# EAGLE design cyclops_r2 (EAGLE 5.07)

## Sheet 1 of 3
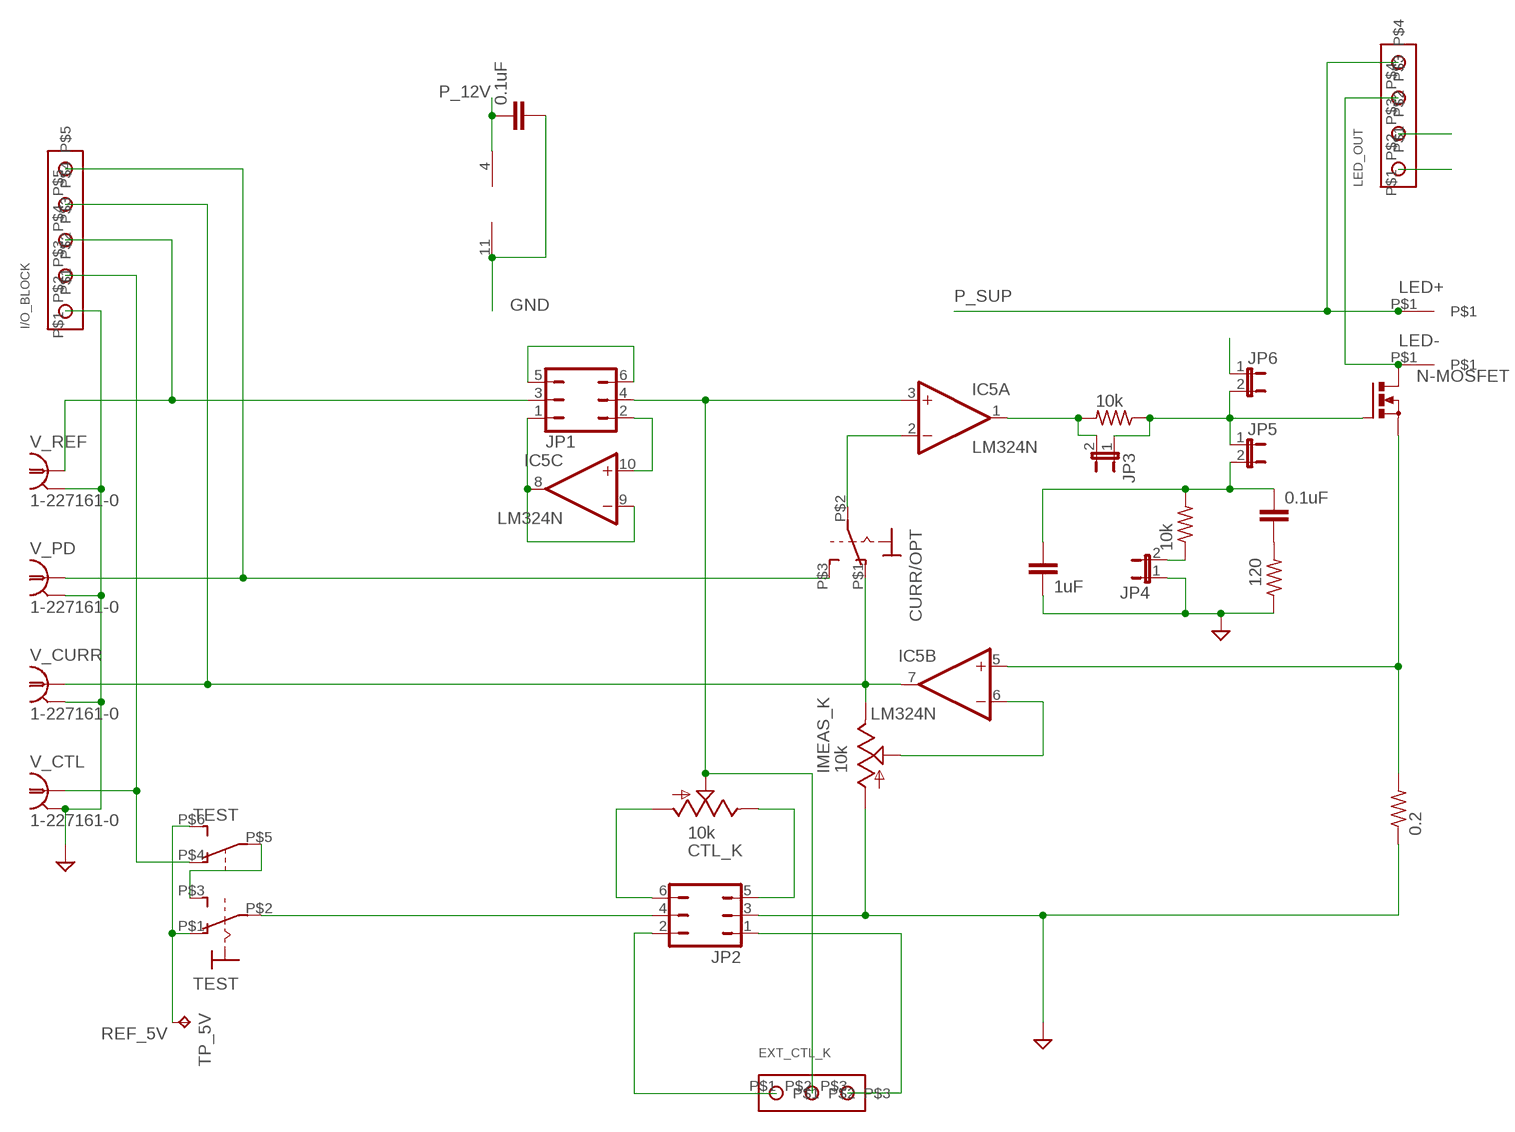
[diagram p0: schematic, sheet 1]

### Parts
C2  0.1uF  C-EU050-024X044  [C050-024X044]
C3  1uF  C-EU025-024X044  [C025-024X044]
C7  0.1uF  C-EU050-024X044  [C050-024X044]
CTL_K  10k  TRIM_US-RJ6S  [RJ6S]
CURR/OPT  SPST_SWITCH  [A_TOGGLE_SPST]
EXT_CTL_K  SCREW3  [SCREW3]
I/O_BLOCK  SCREW5  [SCREW5]
IC5  LM324N  [DIL14]
IMEAS_K  10k  TRIM_US-RJ6S  [RJ6S]
JP1  JP3Q  [JP3Q]
JP2  JP3Q  [JP3Q]
JP3  JP1E  [JP1]
JP4  JP1E  [JP1]
JP5  JP1E  [JP1]
JP6  JP1E  [JP1]
LED+  BANANA_TO_BOARD  [BANANA_TO_BOARD]
LED-  BANANA_TO_BOARD  [BANANA_TO_BOARD]
LED_OUT  SCREW4  [SCREW4]
N-MOSFET  PMOSFET_NTO220BH  [TO220BH]
R3  10k  R-US_0207/7  [0207/7]
R4  10k  R-US_0207/7  [0207/7]
R8  120  R-US_0207/7  [0207/7]
R_CURR  0.2  R-US_  [IMEAS_R]
TEST  SP3T_SWITCH  [320-938]
TP_5V  TPPAD1-13  [P1-13]
V_CTL  1-227161-0  [AMP_227161]
V_CURR  1-227161-0  [AMP_227161]
V_PD  1-227161-0  [AMP_227161]
V_REF  1-227161-0  [AMP_227161]

### Nets
GND: C3.2 C7.2 I/O_BLOCK.P$1 IC5.11(P:V-) IMEAS_K.A JP2.3 JP4.1 LED_OUT.P$1 R8.1 R_CURR.1 V_CTL.2(GND) V_CURR.2(GND) V_PD.2(GND) V_REF.2(GND) ; also sheet 2,3
N$1: CURR/OPT.P$2(P) IC5.2(A:-IN)
N$2: IC5.5(B:+IN) N-MOSFET.S R_CURR.2
N$3: IC5.1(A:OUT) JP3.2 R4.2
N$4: CURR/OPT.P$1(O) I/O_BLOCK.P$4 IC5.7(B:OUT) IMEAS_K.E V_CURR.1
N$5: CURR/OPT.P$3(S) I/O_BLOCK.P$5 V_PD.1
N$6: JP2.4 TEST.P$2(1:P)
N$7: CTL_K.E JP2.5
N$8: CTL_K.S EXT_CTL_K.P$2 IC5.3(A:+IN) JP1.4
N$9: IC5.8(C:OUT) IC5.9(C:-IN) JP1.1
N$10: I/O_BLOCK.P$2 TEST.P$4(B:O) V_CTL.1
N$11: C2.1 C3.1 JP5.2 R3.2
N$12: CTL_K.A JP2.6
N$13: C2.2 R8.2
N$14: IC5.10(C:+IN) JP1.2
N$15: IC5.6(B:-IN) IMEAS_K.S
N$17: JP1.5 JP1.6
N$18: I/O_BLOCK.P$3 JP1.3 V_REF.1
N$21: LED-.P$1 LED_OUT.P$3 N-MOSFET.D
N$23: TEST.P$3(1:S) TEST.P$5(B:P)
N$25: EXT_CTL_K.P$1 JP2.2
N$26: EXT_CTL_K.P$3 JP2.1
N$27: JP4.2 R3.1
N$29: JP3.1 JP5.1 JP6.2 N-MOSFET.G R4.1
N$69: JP6.1
P_12V: C7.1 IC5.4(P:V+) LED_OUT.P$2 ; also sheet 2
P_SUP: LED+.P$1 LED_OUT.P$4 ; also sheet 2,3
REF_5V: TEST.P$1(1:O) TEST.P$6(B:S) TP_5V.TP ; also sheet 2
Unconnected: IC5.12(D:+IN) IC5.13(D:-IN) IC5.14(D:OUT)

## Sheet 2 of 3
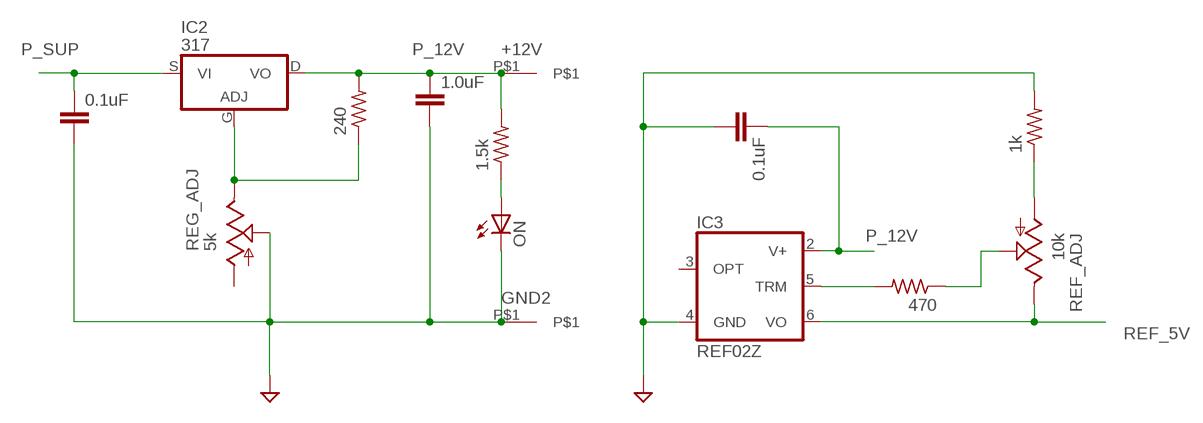
[diagram p1: schematic, sheet 2]

### Parts
+12V  BANANA_TO_BOARD  [BANANA_TO_BOARD]
C4  0.1uF  C-EU050-024X044  [C050-024X044]
C5  1.0uF  C-EU025-024X044  [C025-024X044]
C6  0.1uF  C-EU050-024X044  [C050-024X044]
GND2  BANANA_TO_BOARD  [BANANA_TO_BOARD]
IC2  317  [TO220BH]
IC3  REF02Z  [DIL08]
ON  LED3MM  [LED3MM]
R2  1.5k  R-US_0207/7  [0207/7]
R9  1k  R-US_0207/7  [0207/7]
R10  240  R-US_0207/7  [0207/7]
R12  470  R-US_0207/7  [0207/7]
REF_ADJ  10k  TRIM_US-RJ6S  [RJ6S]
REG_ADJ  5k  TRIM_US-RJ6S  [RJ6S]

### Nets
GND: C4.2 C5.2 C6.2 GND2.P$1 IC3.4(GND) ON.K(C) R9.2 REG_ADJ.S ; also sheet 1,3
N$19: IC2.G(ADJ) R10.1 REG_ADJ.E
N$20: IC3.5(TRM) R12.2
N$22: R12.1 REF_ADJ.S
N$24: R9.1 REF_ADJ.A
N$28: ON.A R2.1
P_12V: +12V.P$1 C5.1 C6.1 IC2.D(VO) IC3.2(V+) R2.2 R10.2 ; also sheet 1
P_SUP: C4.1 IC2.S(VI) ; also sheet 1,3
REF_5V: IC3.6(VO) REF_ADJ.E ; also sheet 1
Unconnected: IC3.3(OPT) REG_ADJ.A

## Sheet 3 of 3
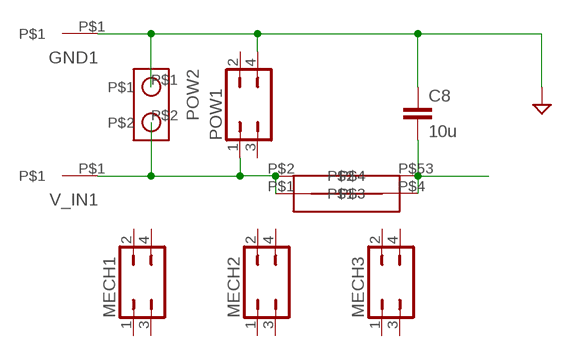
[diagram p2: schematic, sheet 3]

### Parts
C8  10u  C-EU025-024X044  [C025-024X044]
GND1  BANANA_TO_BOARD  [BANANA_TO_BOARD]
MECH1  JP2Q  [JP2Q]
MECH2  JP2Q  [JP2Q]
MECH3  JP2Q  [JP2Q]
POW1  JP2Q  [JP2Q]
POW2  SCREW2  [SCREW2]
U$1  FUSE >2A  NXT-FUSE  [NXT-FUSE]
V_IN1  BANANA_TO_BOARD  [BANANA_TO_BOARD]

### Nets
GND: C8.1 GND1.P$1 POW1.4 POW2.P$1 ; also sheet 1,2
P_SUP: C8.2 U$1.P$4 U$1.P$53 ; also sheet 1,2
P_SUP_BEFORE: POW1.1 POW2.P$2 U$1.P$1 U$1.P$2 V_IN1.P$1
Unconnected: MECH1.1 MECH1.2 MECH1.3 MECH1.4 MECH2.1 MECH2.2 MECH2.3 MECH2.4 MECH3.1 MECH3.2 MECH3.3 MECH3.4 POW1.2 POW1.3

## Library data of the parts
+12V GND1 GND2 LED+ LED- V_IN1 = HOSS:BANANA_TO_BOARD: Female banana socket to board, right angle. Digikey part: J111-ND (or similar).
C2-C8 = rcl:C-EU: CAPACITOR, European symbol
CTL_K IMEAS_K REF_ADJ REG_ADJ = HOSS:TRIM_US-: POTENTIOMETER
CURR/OPT = HOSS:SPST_SWITCH: TOGGLE SWITCH distributor RS Components
EXT_CTL_K = HOSS:SCREW3
I/O_BLOCK = HOSS:SCREW5
IC2 = HOSS:*317: Positive VOLTAGE REGULATOR
IC3 = linear:REF02: VOLTAGE REFERENCE
IC5 = linear:LM324: OP AMP
JP1 JP2 = jumper:JP3Q: JUMPER
JP3-JP6 = jumper:JP1E: JUMPER
LED_OUT = HOSS:SCREW4
MECH1-MECH3 POW1 = jumper:JP2Q: JUMPER
N-MOSFET = transistor-power:PMOSFET_N: Power MOSFET N-Channel
ON = led:LED: LED OSRAM: - CHIPLED LG R971, LG N971, LY N971, LG Q971, LY Q971, LO R971, LY R971 LH N974, LH R974 LS Q976, LO Q976, LY Q976 LO Q996 - Hyper CHIPLED LW Q18S LB Q993, LB Q99A, LB R99A - SideLED LS A670, LO A670, LY A670, LG A670, LP A670 LB A673, LV A673, LT A673, LW A673 LH A674 LY A675 LS A676, LA A676, LO A676, LY A676, LW A676 LS A679, LY A679, LG A679 - Hyper Micro SIDELED® LS Y876, LA Y876, LO Y876, LY Y876 LT Y87S - SmartLED LW L88C, LW L88S LB L89C, LB L89S, LG L890 LS L89K, LO L89K, LY L89K LS L896, LA L896, LO L896, LY L896 - TOPLED LS T670, LO T670, LY T670, LG T670, LP T670 LSG T670, LSP T670, LSY T670, LOP T670, LYG T670 LG T671, LOG T671, LSG T671 LB T673, LV T673, LT T673, LW T673 LH T674 LS T676, LA T676, LO T676, LY T676, LB T676, LH T676, LSB T676, LW T676 LB T67C, LV T67C, LT T67C, LS T67K, LO T67K, LY T67K, LW E67C LS E67B, LA E67B, LO E67B, LY E67B, LB E67C, LV E67C, LT E67C LW T67C LS T679, LY T679, LG T679 LS T770, LO T770, LY T770, LG T770, LP T770 LB T773, LV T773, LT T773, LW T773 LH T774 LS E675, LA E675, LY E675, LS T675 LS T776, LA T776, LO T776, LY T776, LB T776 LHGB T686 LT T68C, LB T68C - Hyper Mini TOPLED® LB M676 - Mini TOPLED Santana® LG M470 LS M47K, LO M47K, LY M47K Source: http://www.osram.convergy.de LUXEON: - LUMILED® LXK2-PW12-R00, LXK2-PW12-S00, LXK2-PW14-U00, LXK2-PW14-V00 LXK2-PM12-R00, LXK2-PM12-S00, LXK2-PM14-U00 LXK2-PE12-Q00, LXK2-PE12-R00, LXK2-PE12-S00, LXK2-PE14-T00, LXK2-PE14-U00 LXK2-PB12-K00, LXK2-PB12-L00, LXK2-PB12-M00, LXK2-PB14-N00, LXK2-PB14-P00, LXK2-PB14-Q00 LXK2-PR12-L00, LXK2-PR12-M00, LXK2-PR14-Q00, LXK2-PR14-R00 LXK2-PD12-Q00, LXK2-PD12-R00, LXK2-PD12-S00 LXK2-PH12-R00, LXK2-PH12-S00 LXK2-PL12-P00, LXK2-PL12-Q00, LXK2-PL12-R00 Source: www.luxeon.com KINGBRIGHT: KA-3528ASYC Source: www.kingbright.com
POW2 = HOSS:SCREW2
R2-R4 R8-R10 R12 R_CURR = HOSS:R-US_: RESISTOR, American symbol
TEST = HOSS:SP3T_SWITCH: TOGGLE SWITCH distributor RS Components
TP_5V = testpad:TP: Test pad
U$1 = HOSS:NXT-FUSE
V_CTL V_CURR V_PD V_REF = con-coax:?227161*: JACK, RIGHT ANGLE, 50 OHM, PCB, BNC Source: amp_227161.pdf

## Board
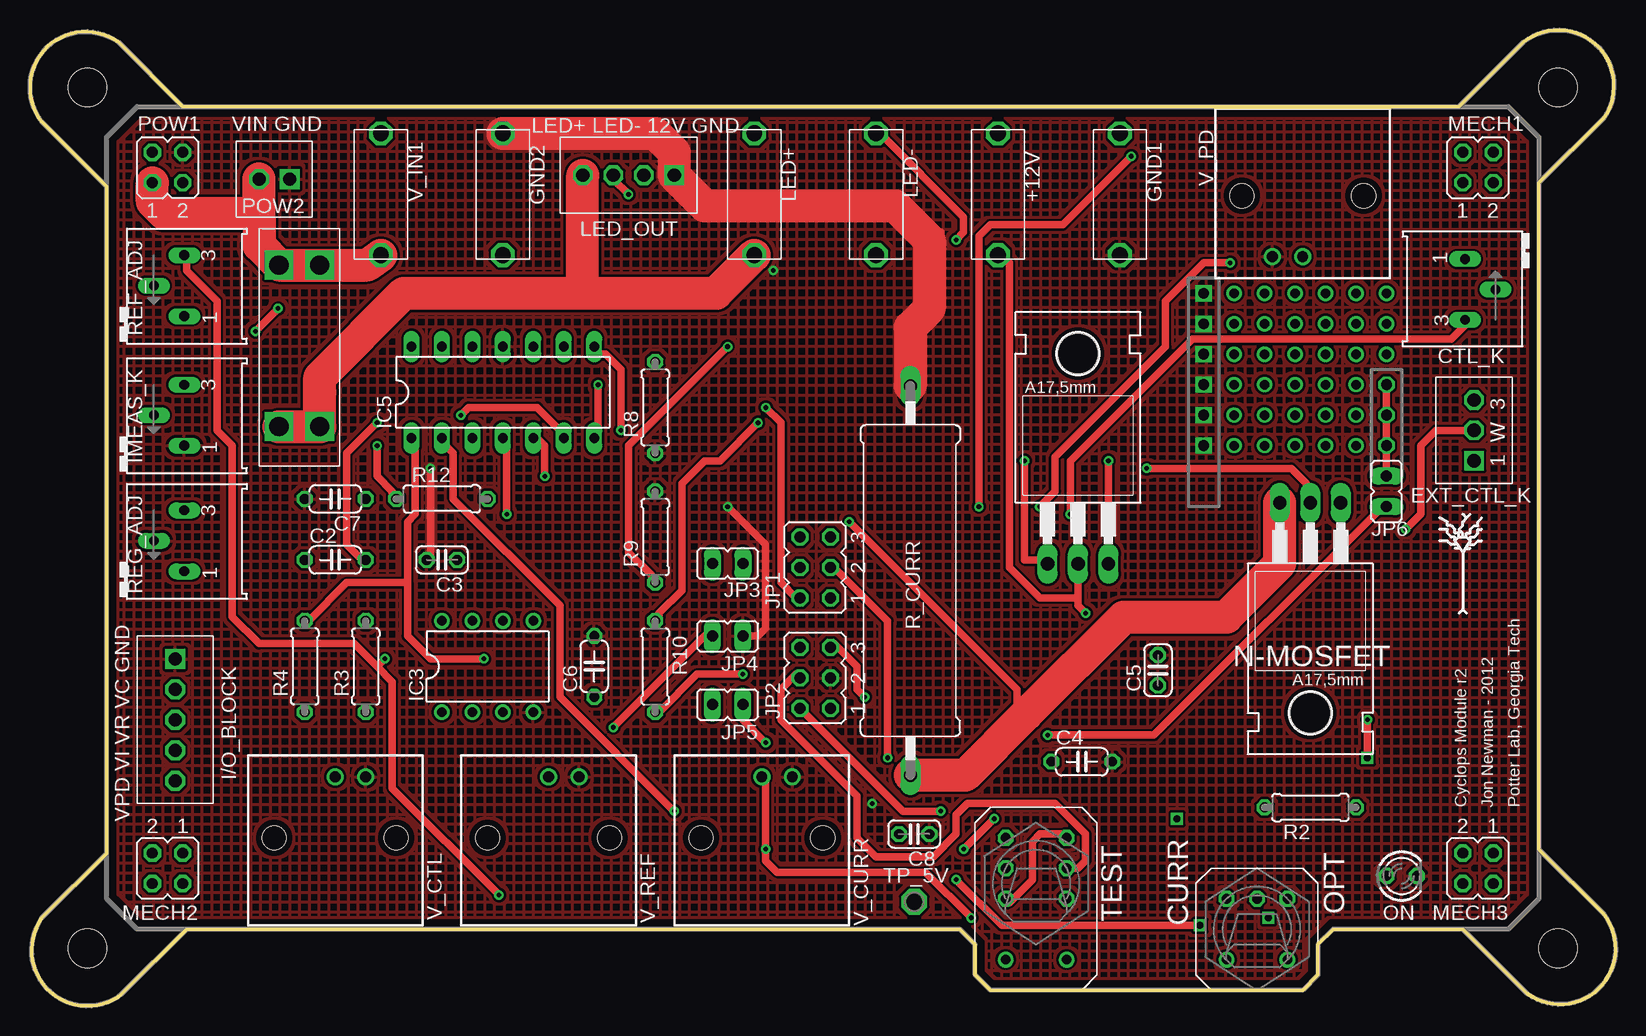
[diagram p3: board, top side]
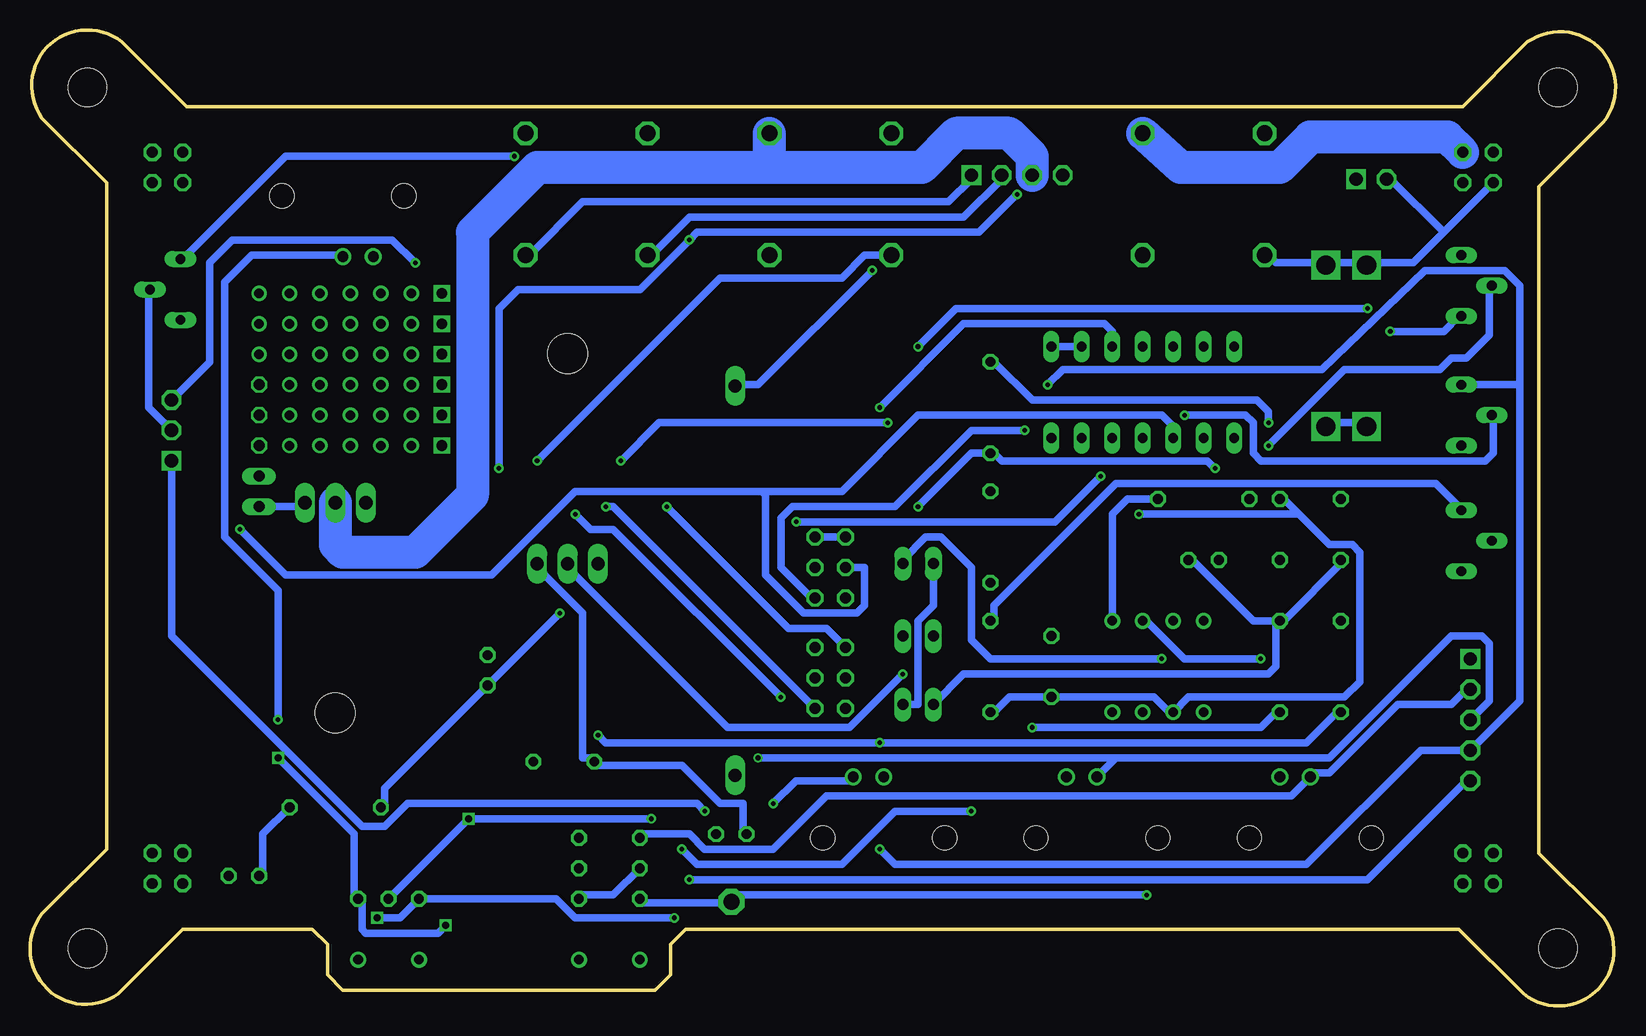
[diagram p4: board, bottom side, seen from below]

Size 132.17 x 81.37 mm. Coordinates in mm from the lower left corner, seen from the top.
Outline: 6.4,12.75 6.4,68.31 1,73.71 arc-164 7.35,80.37 12.75,74.98 119.11,74.98 124.51,80.37 arc-164 131.17,74.02 125.78,68.63 125.78,13.06 131.17,7.67 arc-164 124.82,1 119.43,6.4 108.63,6.4 107.36,5.13 107.36,2.59 106.09,1.32 80.06,1.32 78.79,2.59 78.79,5.13 77.52,6.4 13.06,6.4 7.67,1 arc-164 1,7.35 6.4,12.75
Copper layers (1*16): Top 0.035mm / dielectric 1.5mm / Bottom 0.035mm
Design rules "default *": minimum track width 24mil, minimum drill 15mil, track to track 8mil, track to pad 8mil, pad to pad 8mil, via to via 8mil, smd to smd 8mil, copper to edge 20mil, drill to drill 8mil, minimum pad ring 10mil, minimum via ring 8mil, stop-mask expansion 4mil, vias tented up to drill 0mil, thermal gap 10mil
Holes 3.2 mm at 127.36,76.56 4.81,4.81 127.36,4.81 4.81,76.56
tKeepout: area 77.8,41 to 96.9,58.8; area 97.2,20 to 116.3,37.8

### Footprints (pad centres in the part's own frame; a part is rotated, then mirrored left to right if it is on the bottom)
BANANA_TO_BOARD = drill 1.321 octagon: P$1 0,0; P$2 10.16,0
C050-024X044 = drill 0.813 octagon: 1 -2.54,0; 2 2.54,0
C025-024X044 = drill 0.813 octagon: 1 -1.27,0; 2 1.27,0
RJ6S = drill 0.813 long: A 2.54,-0.2; E -2.54,-0.2; S 0,-2.74
A_TOGGLE_SPST = drill 0.8 octagon: P$1 -2.54,6.35; P$2 0,6.35; P$3 2.54,6.35 | drill 0.8 round: P$14 2.54,1.27; P$15 -2.54,1.27
SCREW3 = drill 1.1 square: P$1 0,0 | drill 1.1 octagon: P$2 2.54,0; P$3 5.08,0
SCREW5 = drill 1.1 square: P$1 0,0 | drill 1.1 octagon: P$2 2.54,0; P$3 5.08,0; P$4 7.62,0; P$5 10.16,0
TO220BH = drill 1.118 long: D 0,-6.35; G -2.54,-6.35; S 2.54,-6.35 | hole 3.302: 0,11.176
DIL08 = drill 0.813 pad 1.27 round: 1 -3.81,-3.81; 2 -1.27,-3.81; 3 1.27,-3.81; 4 3.81,-3.81; 5 3.81,3.81; 6 1.27,3.81; 7 -1.27,3.81; 8 -3.81,3.81
DIL14 = drill 0.813 long: 1 -7.62,-3.81; 2 -5.08,-3.81; 3 -2.54,-3.81; 4 0,-3.81; 5 2.54,-3.81; 6 5.08,-3.81; 7 7.62,-3.81; 8 7.62,3.81; 9 5.08,3.81; 10 2.54,3.81; 11 0,3.81; 12 -2.54,3.81; 13 -5.08,3.81; 14 -7.62,3.81
JP3Q = drill 0.914 octagon: 1 -2.54,-1.27; 2 -2.54,1.27; 3 0,-1.27; 4 0,1.27; 5 2.54,-1.27; 6 2.54,1.27
JP1 = drill 0.914 long: 1 0,-1.27; 2 0,1.27
SCREW4 = drill 1.1 square: P$1 0,0 | drill 1.1 octagon: P$2 2.54,0; P$3 5.08,0; P$4 7.62,0
JP2Q = drill 0.914 octagon: 1 -1.27,-1.27; 2 -1.27,1.27; 3 1.27,-1.27; 4 1.27,1.27
LED3MM = drill 0.813 octagon: A -1.27,0; K 1.27,0
SCREW2 = drill 1.1 square: P$1 0,0 | drill 1.1 octagon: P$2 2.54,0
0207/7 = drill 0.813 octagon: 1 -3.81,0; 2 3.81,0
IMEAS_R = drill 1.1 long: 1 -3.23,0; 2 29.23,0
320-938 = drill 0.8 octagon: P$1 2.54,3.81; P$2 2.54,1.27; P$3 2.54,-1.27; P$4 -2.54,3.81; P$5 -2.54,1.27; P$6 -2.54,-1.27 | drill 0.8 round: P$14 2.54,-6.35; P$15 -2.54,-6.35
P1-13 = drill 1.321 pad 2.159 octagon: TP 0,0
NXT-FUSE = drill 1.6 square: P$1 3.048,1.651; P$2 3.048,5.055; P$4 16.51,5.055; P$53 16.51,1.651
AMP_227161 = drill 0.9 pad 1.27 round: 1 0,-5.08; 2 -2.54,-5.08 | hole 2: -5.08,0; 5.08,0

### Placement (x,y rotation side)
+12V  80.69,62.59 90 top
C2  25.45,37.19 0 top
C3  34.34,37.19 180 top
C4  87.68,20.37 0 top
C5  94.03,27.99 90 top
C6  47.04,28.3 90 top
C7  25.45,42.27 180 top
C8  73.71,14.33 180 top
CTL_K  119.43,59.74 90 top
CURR/OPT  102.28,2.59 0 top
EXT_CTL_K  120.38,45.45 90 top
GND1  90.85,62.59 90 top
GND2  39.42,72.75 270 top
I/O_BLOCK  12.11,28.94 270 top
IC2  87.36,43.23 0 top
IC3  38.15,28.3 0 top
IC5  39.42,51.16 0 top
IMEAS_K  13.06,49.26 270 top
JP1  65.45,36.56 90 top
JP2  65.45,27.35 90 top
JP3  58.15,36.88 270 top
JP4  58.15,30.84 90 top
JP5  58.15,25.13 90 top
JP6  113.08,42.91 180 top
LED+  60.37,62.59 90 top
LED-  70.53,72.75 270 top
LED_OUT  53.7,69.26 180 top
MECH1  120.7,69.9 0 top
MECH2  11.48,11.48 180 top
MECH3  120.7,11.48 180 top
N-MOSFET  106.73,35.61 180 top
ON  114.35,10.84 0 top
POW1  11.48,69.9 0 top
POW2  21.64,68.94 180 top
R2  106.73,16.56 180 top
R3  27.99,28.3 90 top
R4  22.91,28.3 90 top
R8  52.12,49.89 90 top
R9  52.12,39.1 90 top
R10  52.12,28.3 270 top
R12  34.34,42.27 0 top
R_CURR  73.39,48.46 270 top
REF_ADJ  13.06,60.05 270 top
REG_ADJ  13.06,38.78 270 top
TEST  83.87,10.21 0 top
TP_5V  73.71,8.68 0 top
U$1  19.1,64.82 270 top
V_CTL  25.45,14.02 180 top
V_CURR  61.01,14.02 180 top
V_IN1  29.26,62.59 90 top
V_PD  106.09,67.55 0 top
V_REF  43.23,14.02 180 top

### Tracks (layer width: path | path; a pad name or v marks a point on that pad's centre or on a via)
GND  (via drill 0.38, 0.9)
  Top 0.61: 74.98,63.86 75.93,64.5 | v33.38,44.81 33.38,37.19 C3.2 | v58.15,41.64 61.32,38.46 61.32,31.48 60.69,30.84 JP4.1
  Top 2.769: R_CURR.1 73.39,56.56 74.98,58.15 74.98,63.86 72.12,66.72 56.24,66.72 LED_OUT.P$1 53.7,71.17 52.12,72.75 GND2.P$1
  Bottom 0.61: LED_OUT.P$1 53.7,68.94 55.61,67.04 86.09,67.04 90.53,62.59 GND1.P$1 | v61.96,61.32 71.48,51.8 73.39,51.8 R_CURR.1 | v70.21,16.87 68.31,18.78 63.86,18.78 V_CURR.2 | v33.38,44.81 34.02,45.45 51.16,45.45 51.8,46.08 R8.1 53.7,46.08 v58.15,41.64
  Bottom 2.769: GND2.P$1 36.24,69.9 27.99,69.9 25.45,72.44 14.02,72.44 POW1.4
  other vias: 97.84,46.72 97.84,49.26 97.84,51.8 97.84,54.34 97.84,56.88 97.84,59.42
  pour Top (hatched): 7.35,72.12 9.25,74.02 122.92,74.02 124.82,72.12 124.82,9.25 122.92,7.35 108.31,7.35 106.41,5.44 106.41,2.9 105.77,2.27 80.37,2.27 79.74,2.9 79.74,5.44 77.83,7.35 9.25,7.35 7.35,9.25
N$1  (via drill 0.38, 0.6)
  Top 0.61: v77.83,13.06 v80.37,15.6 | v53.7,16.24 44.18,25.76 44.18,33.38 35.29,42.27 35.29,46.08 34.65,46.72 34.65,47.35 IC5.2
  Bottom 0.61: v80.37,15.6 v95.61,15.6 CURR/OPT.P$2 | v77.83,13.06 76.56,11.79 64.5,11.79 60.05,16.24 v53.7,16.24
N$2  (via drill 0.38)
  Top 0.61: v42.91,44.18 42.91,46.72 42.27,47.35 IC5.5 | v68.31,40.37 82.28,26.4 82.28,25.13 83.07,24.33
  Top 2.769: N-MOSFET.S 104.19,36.88 99.74,32.43 91.17,32.43 83.07,24.33 77.97,19.23 R_CURR.2
  Bottom 0.61: v42.91,44.18 46.72,40.37 v68.31,40.37
N$3  (via drill 0.38)
  Top 0.61: R4.2 23.22,32.11 26.4,35.29 31.48,35.29 | IC5.1 32.11,47.35 32.11,41 31.48,40.37 31.48,35.29 | v37.83,28.94 33.38,28.94 31.48,30.84 31.48,35.29
  Bottom 0.61: JP3.2 59.42,37.19 57.51,39.1 56.24,39.1 53.7,36.56 53.7,30.53 52.12,28.94 v37.83,28.94
N$4  (via drill 0.38, 0.6)
  Top 0.61: v78.47,7.35 74.66,11.16 62.28,11.16 61.32,12.11 v61.32,13.06 61.32,18.78 V_CURR.1 | v47.35,51.8 47.35,47.35 IC5.7
  Bottom 0.61: v47.35,51.8 46.08,53.07 24.49,53.07 15.92,61.32 9.25,61.32 7.98,60.05 7.98,51.8 | v61.32,13.06 60.05,11.79 25.76,11.79 16.24,21.32 I/O_BLOCK.P$4 7.98,25.45 7.98,51.8 | 7.98,51.8 IMEAS_K.E | v103.23,7.35 101.33,7.35 CURR/OPT.P$1 88.31,8.94 86.72,7.35 v78.47,7.35
N$5  (via drill 0.38, 0.6)
  Top 0.61: v111.49,20.68 v111.49,23.86 | v77.2,10.52 81.01,6.71 v97.52,6.71
  Bottom 0.61: v77.2,10.52 20.68,10.52 12.43,18.78 I/O_BLOCK.P$5 | V_PD.1 106.22,62.59 113.71,62.59 115.93,60.37 115.93,39.1 111.49,34.65 v111.49,23.86 | v97.52,6.71 98.15,6.08 104.19,6.08 104.5,6.4 104.5,8.62 CURR/OPT.P$3 105.14,9.25 105.14,14.33 v111.49,20.68
N$6
  Top 0.61: JP2.4 63.86,27.67 62.59,26.4 62.59,23.86 68.94,17.51 68.94,14.02 70.53,12.43 75.29,12.43 77.2,14.33 77.2,15.92 78.15,16.87 85.45,16.87 87.99,14.33 87.99,12.11 87.36,11.48 TEST.P$2
N$7  (via drill 0.38)
  Top 0.61: v86.72,41 86.72,45.45 96.88,55.61 118.47,55.61 119.63,56.76 CTL_K.E | v69.58,25.76 68.94,26.4 68.94,28.3 67.04,30.21 JP2.5
  Bottom 0.61: v69.58,25.76 83.55,39.73 85.45,39.73 v86.72,41
N$8  (via drill 0.38)
  Top 0.61: v114.66,39.73 115.93,41 115.93,46.72 117.2,47.99 EXT_CTL_K.P$2
  Bottom 0.61: CTL_K.S 122.28,59.42 122.28,49.89 EXT_CTL_K.P$2 | JP1.4 62.59,36.56 62.59,33.38 63.23,32.75 67.67,32.75 70.85,35.92 70.85,42.59 71.17,42.91 | v114.66,39.73 110.85,35.92 93.71,35.92 86.72,42.91 71.17,42.91 | 71.17,42.91 64.5,42.91 58.15,49.26 37.83,49.26 36.88,48.31 IC5.3
N$9  (via drill 0.38)
  Top 0.61: v49.26,47.99 49.26,53.07 47.99,54.34 47.35,54.34 47.35,54.97 IC5.8
  Bottom 0.61: IC5.9 IC5.8 | v49.26,47.99 53.7,47.99 60.05,41.64 68.63,41.64 69.58,40.69 69.58,36.56 67.04,34.02 JP1.1
N$10
  Bottom 0.61: TEST.P$4 81.01,14.33 77.2,14.33 75.93,13.06 70.21,13.06 65.77,17.51 27.03,17.51 V_CTL.1 25.13,19.41 23.86,19.41 18.14,25.13 13.7,25.13 12.43,26.4 I/O_BLOCK.P$2
N$11
  Bottom 0.61: C2.1 22.59,37.19 27.67,32.11 R3.2 28.3,32.11 | 28.3,32.11 30.21,32.11 35.29,37.19 C3.1 | JP5.2 54.34,27.67 28.94,27.67 28.3,28.3 28.3,32.11
N$12  (via drill 0.38)
  Top 0.61: v91.8,70.85 86.09,65.13 80.06,65.13 79.1,64.18 v79.1,41.64
  Bottom 0.61: v91.8,70.85 110.85,70.85 119.11,62.59 CTL_K.A | v79.1,41.64 68.94,31.48 65.77,31.48 JP2.6
N$13  (via drill 0.38)
  Top 0.61: v28.94,48.62 26.4,46.08 26.4,38.46 27.67,37.19 C2.2
  Bottom 0.61: R8.2 51.8,53.7 48.62,50.53 29.89,50.53 28.94,49.58 v28.94,48.62
N$14  (via drill 0.38)
  Top 0.61: v61.32,49.89 62.59,48.62 62.59,35.29 63.86,34.02 JP1.2
  Bottom 0.61: v61.32,49.89 54.34,56.88 42.59,56.88 41.96,56.24 IC5.10
N$15  (via drill 0.38)
  Top 0.61: v35.92,49.26 36.56,49.89 42.27,49.89 44.18,47.99 44.18,47.35 IC5.6
  Bottom 0.61: 10.52,49.26 IMEAS_K.S 10.21,49.14 10.21,46.08 10.84,45.45 29.57,45.45 30.21,46.08 30.21,48.62 30.84,49.26 v35.92,49.26
N$17
  Bottom 0.61: JP1.6 JP1.5
N$18  (via drill 0.38)
  Top 0.61: v71.48,20.68 71.48,32.11 67.04,36.56 JP1.3
  Bottom 0.61: 41.64,20.68 23.86,20.68 13.7,30.84 11.16,30.84 10.52,30.21 10.52,25.45 I/O_BLOCK.P$3 | 41.64,20.68 V_REF.1 | 41.64,20.68 v71.48,20.68
N$19  (via drill 0.38)
  Top 0.61: v82.91,45.45 82.91,37.19 84.82,37.19 IC2.G | v60.69,48.62 57.51,45.45 56.24,45.45 54.34,43.54 54.34,34.65 52.43,32.75 52.43,32.11 R10.1
  Bottom 0.61: v82.91,45.45 79.74,48.62 v60.69,48.62 | REG_ADJ.E 13.06,41.64 14.97,43.54 41.64,43.54 51.8,33.38 51.8,32.11 R10.1
N$20
  Bottom 0.61: 41.64,32.11 IC3.5 41.96,41 40.69,42.27 R12.2
N$21  (via drill 0.38)
  Top 0.61: v49.89,67.67 48.62,68.94 LED_OUT.P$3 | v77.2,63.86 77.83,64.5 77.83,65.77 70.85,72.75 LED-.P$1 | v93.07,44.81 105.14,44.81 106.41,43.54 106.41,42.27 N-MOSFET.D
  Bottom 0.61: v49.89,67.67 53.07,64.5 76.56,64.5 v77.2,63.86 81.33,59.74 91.49,59.74 93.07,58.15 v93.07,44.81
  Bottom 2.769: N-MOSFET.D 106.73,38.46 106.09,37.83 100.06,37.83 95.3,42.59 95.3,64.5 89.9,69.9 70.53,69.9 | LED_OUT.P$3 48.62,70.85 50.53,72.75 54.97,72.75 57.83,69.9 70.53,69.9 | 70.53,69.9 LED-.P$1
N$22  (via drill 0.38)
  Top 0.61: v28.94,46.72 28.94,44.18 30.21,42.91 30.21,42.27 R12.1
  Bottom 0.61: v28.94,46.72 22.59,53.07 14.65,53.07 13.7,54.02 12.43,54.02 10.52,55.93 10.52,59.85 REF_ADJ.S 10.52,60.05
N$23
  Bottom 0.61: TEST.P$5 83.55,9.25 86.09,9.25 TEST.P$3
N$24  (via drill 0.38)
  Top 0.61: v18.78,56.24 v20.68,58.15 | v58.15,54.97 49.89,46.72 49.89,37.83 51.8,35.92 51.8,35.29 R9.1
  Bottom 0.61: v18.78,56.24 14.33,56.24 13.06,57.51 REF_ADJ.A | v20.68,58.15 54.97,58.15 v58.15,54.97
N$25  (via drill 0.38)
  Top 0.61: v75.93,16.24 72.75,16.24 JP2.2
  Bottom 0.61: v75.93,16.24 76.56,16.87 100.69,16.87 102.6,14.97 104.5,14.97 120.38,30.84 EXT_CTL_K.P$1
N$26  (via drill 0.38)
  Top 0.61: v84.18,41.64 85.45,42.91 85.45,45.77 94.66,54.97 94.66,58.78 97.84,61.96 v100.06,61.96
  Bottom 0.61: v84.18,41.64 83.55,41.64 JP2.1 | v100.06,61.96 101.96,63.86 115.3,63.86 117.2,61.96 117.2,53.7 EXT_CTL_K.P$3
N$27  (via drill 0.38)
  Top 0.61: v48.62,23.22 56.24,30.84 JP4.2
  Bottom 0.61: v48.62,23.22 29.57,23.22 28.3,24.49 R3.1
N$28
  Bottom 0.61: ON.A 112.76,11.16 112.76,14.33 R2.1 110.85,16.24
N$29  (via drill 0.38)
  Top 0.61: v84.82,22.59 93.71,22.59 112.76,41.64 JP6.2 | v61.32,21.95 59.42,23.86 JP5.1
  Bottom 0.61: JP6.2 109.58,41.64 N-MOSFET.G | v84.82,22.59 84.18,21.95 v61.32,21.95 25.76,21.95 23.22,24.49 R4.1 | JP5.1 58.15,25.13 58.15,32.11 56.88,33.38 JP3.1
N$32  (via drill 0.8 pad 1.27)
  other vias: 100.38,56.88
N$33  (via drill 0.8 pad 1.27)
  other vias: 113.08,54.34
N$34  (via drill 0.8 pad 1.27)
  other vias: 113.08,56.88
N$35  (via drill 0.8 pad 1.27)
  other vias: 110.54,56.88
N$36  (via drill 0.8 pad 1.27)
  other vias: 108,56.88
N$37  (via drill 0.8 pad 1.27)
  other vias: 105.46,56.88
N$38  (via drill 0.8 pad 1.27)
  other vias: 102.92,56.88
N$39  (via drill 0.8 pad 1.27)
  other vias: 105.46,46.72
N$40  (via drill 0.8 pad 1.27)
  other vias: 100.38,59.42
N$41  (via drill 0.8 pad 1.27)
  other vias: 102.92,59.42
N$42  (via drill 0.8 pad 1.27)
  other vias: 100.38,54.34
N$43  (via drill 0.8 pad 1.27)
  other vias: 102.92,54.34
N$44  (via drill 0.8 pad 1.27)
  other vias: 105.46,54.34
N$45  (via drill 0.8 pad 1.27)
  other vias: 108,54.34
N$46  (via drill 0.8 pad 1.27)
  other vias: 110.54,54.34
N$47  (via drill 0.8 pad 1.27)
  other vias: 110.54,51.8
N$48  (via drill 0.8 pad 1.27)
  other vias: 108,51.8
N$49  (via drill 0.8 pad 1.27)
  other vias: 105.46,51.8
N$50  (via drill 0.8 pad 1.27)
  other vias: 102.92,51.8
N$51  (via drill 0.8 pad 1.27)
  other vias: 100.38,51.8
N$52  (via drill 0.8 pad 1.27)
  other vias: 105.46,59.42
N$53  (via drill 0.8 pad 1.27)
  other vias: 108,59.42
N$54  (via drill 0.8 pad 1.27)
  other vias: 100.38,49.26
N$55  (via drill 0.8 pad 1.27)
  other vias: 102.92,49.26
N$56  (via drill 0.8 pad 1.27)
  other vias: 105.46,49.26
N$57  (via drill 0.8 pad 1.27)
  other vias: 108,49.26
N$58  (via drill 0.8 pad 1.27)
  other vias: 110.54,49.26
N$59  (via drill 0.8 pad 1.27)
  other vias: 110.54,46.72
N$60  (via drill 0.8 pad 1.27)
  other vias: 108,46.72
N$62  (via drill 0.8 pad 1.27)
  other vias: 102.92,46.72
N$63  (via drill 0.8 pad 1.27)
  other vias: 100.38,46.72
N$64  (via drill 0.8 pad 1.27)
  other vias: 110.54,59.42
N$65  (via drill 0.8 pad 1.27)
  other vias: 113.08,59.42
N$69  (via drill 0.9)
  Top 0.61: v113.08,51.8 v113.08,49.26 v113.08,46.72 JP6.1
P_12V  (via drill 0.38)
  Top 0.61: v39.73,41 39.73,47.35 IC5.4 | v87.99,32.75 87.36,33.38 87.36,34.02 | IC2.D 87.36,34.02 | 87.36,34.02 84.18,34.02 81.64,36.56 81.64,61.96 81.01,62.59 +12V.P$1 | v59.42,27.67 55.61,27.67 52.43,24.49 R10.2
  Bottom 0.61: LED_OUT.P$2 51.16,68.94 54.34,65.77 77.2,65.77 80.37,62.59 +12V.P$1 | R2.2 102.6,16.87 102.6,18.14 C5.1 v87.99,32.75 | R10.2 51.8,24.49 50.53,25.76 C6.1 38.46,25.76 37.19,24.49 IC3.2 35.61,25.76 22.59,25.76 21.32,27.03 21.32,37.83 21.95,38.46 23.86,38.46 26.4,41 | 26.4,41 27.67,42.27 C7.1 | 26.4,41 v39.73,41 | v59.42,27.67 63.86,23.22 74.02,23.22 87.36,36.56 IC2.D
P_SUP  (via drill 0.38)
  Top 0.61: v89.9,45.45 IC2.S | 57.2,59.42 57.51,59.1 | 24.15,51.16 24.49,51.16 24.18,52.43
  Top 2.769: LED+.P$1 57.2,59.42 46.08,59.42 | 46.08,59.42 LED_OUT.P$4 | 46.08,59.42 31.16,59.42 24.18,52.43 | 24.15,52.41 24.15,51.16 U$1.P$4 U$1.P$53
  Bottom 0.61: C8.2 72.75,14.33 72.75,16.87 74.66,16.87 77.83,20.05 84.82,20.05 C4.1 85.45,20.68 86.09,20.68 86.09,32.75 89.9,36.56 IC2.S | U$1.P$53 21.32,48.62 23.86,48.62 U$1.P$4 | v89.9,45.45 74.66,60.69 64.5,60.69 62.59,62.59 LED+.P$1
P_SUP_BEFORE
  Top 2.769: 19.1,65.77 19.1,63.42 U$1.P$1 28.11,61.77 V_IN1.P$1 | 19.1,65.77 POW2.P$2 | POW1.1 10.21,67.04 11.16,66.09 18.78,66.09 19.1,65.77
  Bottom 0.61: V_IN1.P$1 28.94,62.59 28.3,61.96 24.49,61.96 U$1.P$2 23.86,61.96 21.32,61.96 U$1.P$1 20.68,61.96 16.87,61.96 14.33,64.5 | POW1.1 14.33,64.5 | 14.33,64.5 18.78,68.94 POW2.P$2
REF_5V  (via drill 0.38)
  Top 0.61: TEST.P$6 81.64,8.62 83.55,10.52 83.55,13.7 84.18,14.33 86.09,14.33 TEST.P$1 | REF_ADJ.E 13.06,62.59 13.06,61.32 15.6,58.78 15.6,47.99 16.87,46.72 16.87,32.43 19.1,30.21 27.03,30.21 28.94,28.3 | v39.1,9.25 30.21,18.14 30.21,27.03 28.94,28.3 | 28.94,28.3 v29.57,28.94
  Bottom 0.61: TEST.P$6 81.01,8.62 74.02,8.62 TP_5V.TP 73.39,9.25 v39.1,9.25 | v29.57,28.94 35.92,28.94 39.1,32.11 IC3.6

### Text on the board
tPlace: VIN GND | LED+ LED- 12V GND | 1 W 3 | VPD VI VR VC GND | OPT | CURR
tNames: Cyclops Module r2 | Jon Newman - 2012 | Potter Lab, Georgia Tech
tDocu: V_GATE | GND | + | + | + | +